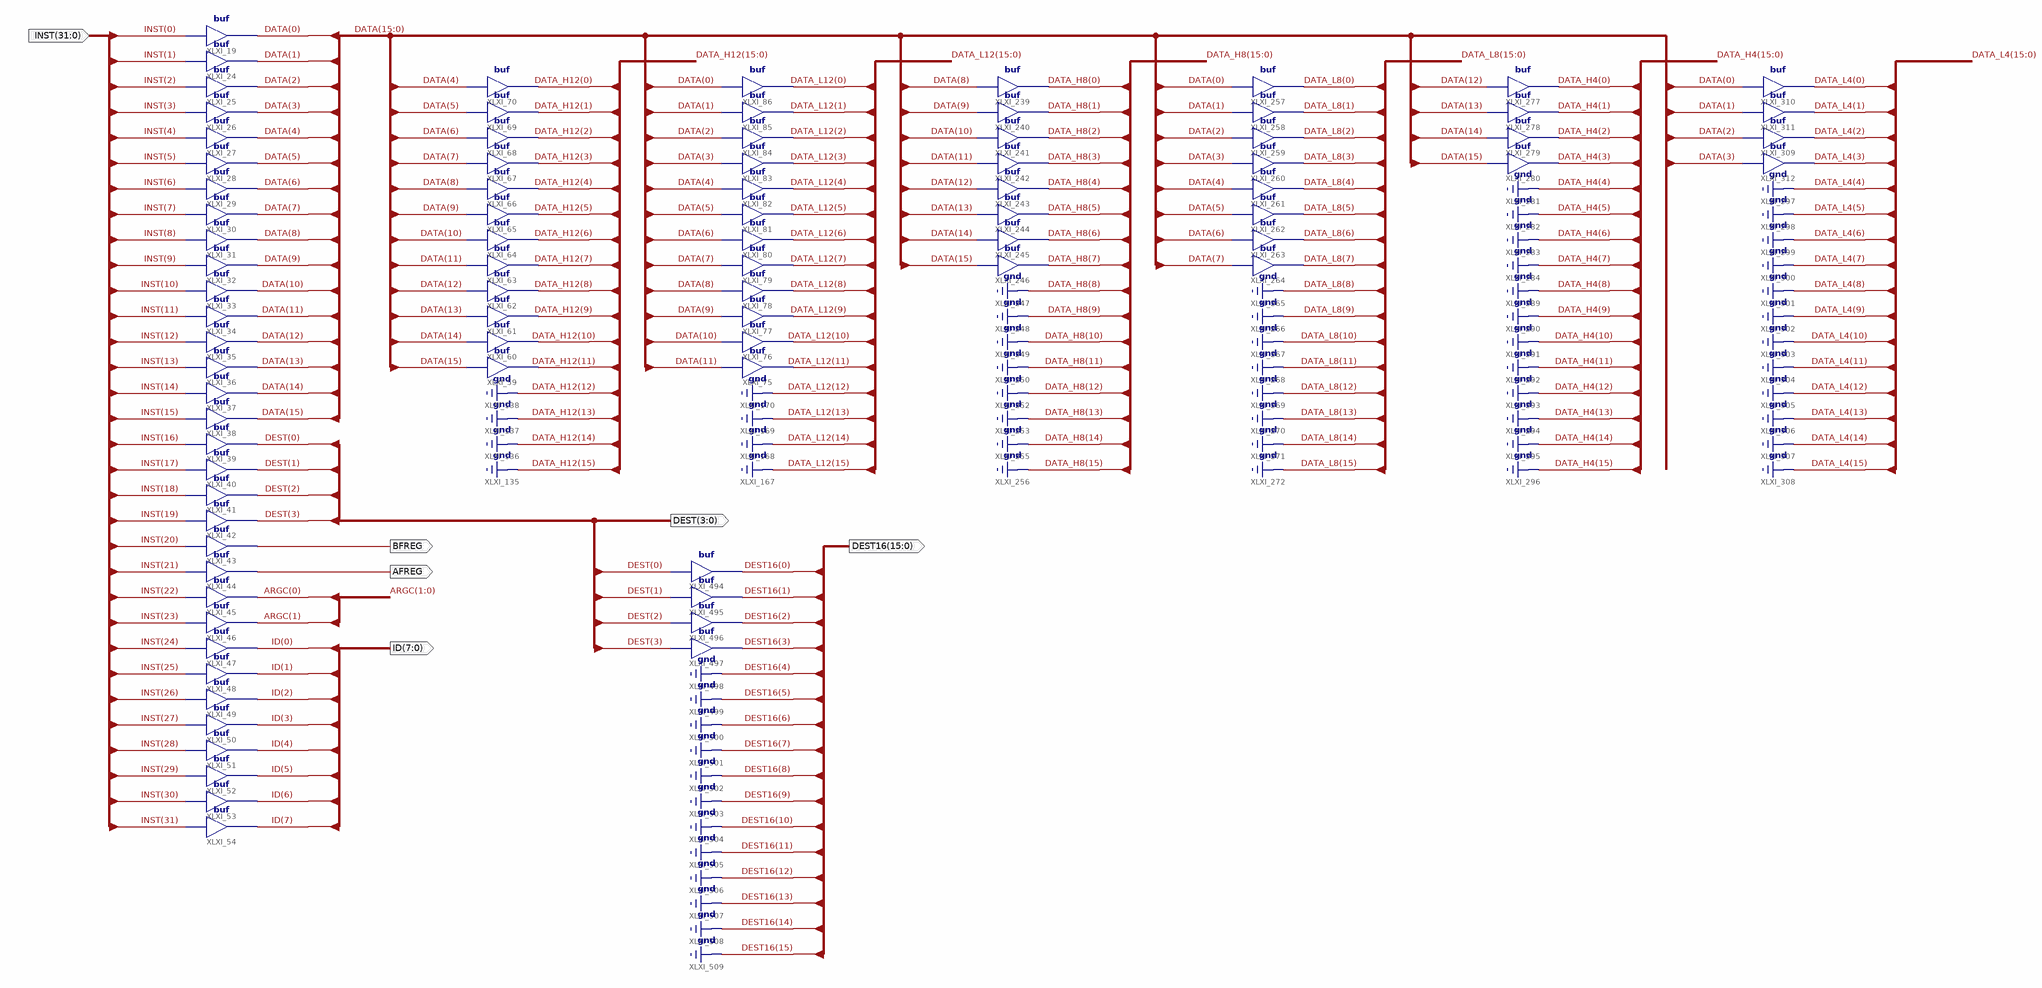
[diagram p0: schematic sheet 1]
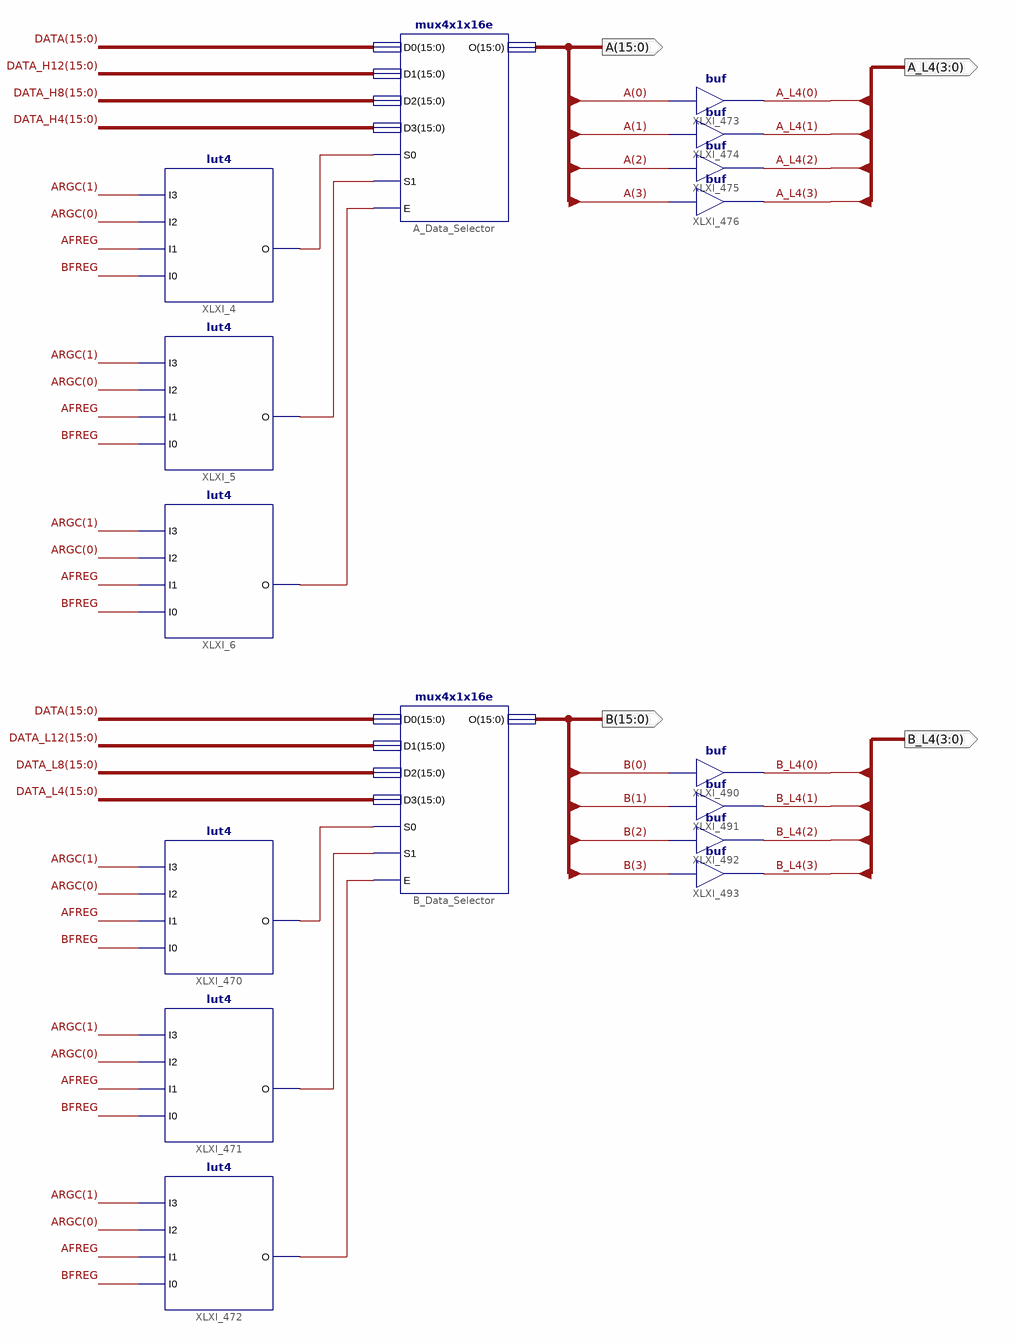
[diagram p1: schematic sheet 2]
// Xilinx ISE schematic idu.sch (spartan6) as structural Verilog: 100 symbols, 10 ports
module idu (
  input  [31:0] INST,
  output [15:0] A,
  output [7:0] ID,
  output [3:0] DEST,
  output BFREG,
  output AFREG,
  output [15:0] B,
  output [3:0] A_L4,
  output [3:0] B_L4,
  output [15:0] DEST16
);

  wire XLXN_3, XLXN_5, XLXN_6, XLXN_833, XLXN_834, XLXN_835;
  wire [1:0] ARGC;
  wire [3:0] DATA_H4, DATA_L4;
  wire [7:0] DATA_H8, DATA_L8;
  wire [11:0] DATA_H12, DATA_L12;
  wire [15:0] DATA;

  mux4x1x16e A_Data_Selector (
    .D0(DATA), .D1({4'b0000, DATA_H12}), .D2({{8{1'b0}}, DATA_H8}), .D3({{12{1'b0}}, DATA_H4}), .E(XLXN_6),
    .O(A), .S0(XLXN_3), .S1(XLXN_5));
  lut4 #(.INIT("0600")) XLXI_4 (.I0(BFREG), .I1(AFREG), .I2(ARGC[0]), .I3(ARGC[1]), .O(XLXN_3));
  lut4 #(.INIT("0D00")) XLXI_5 (.I0(BFREG), .I1(AFREG), .I2(ARGC[0]), .I3(ARGC[1]), .O(XLXN_5));
  lut4 #(.INIT("0FF0")) XLXI_6 (.I0(BFREG), .I1(AFREG), .I2(ARGC[0]), .I3(ARGC[1]), .O(XLXN_6));
  buf XLXI_19 (DATA[0], INST[0]);
  buf XLXI_24 (DATA[1], INST[1]);
  buf XLXI_25 (DATA[2], INST[2]);
  buf XLXI_26 (DATA[3], INST[3]);
  buf XLXI_27 (DATA[4], INST[4]);
  buf XLXI_28 (DATA[5], INST[5]);
  buf XLXI_29 (DATA[6], INST[6]);
  buf XLXI_30 (DATA[7], INST[7]);
  buf XLXI_31 (DATA[8], INST[8]);
  buf XLXI_32 (DATA[9], INST[9]);
  buf XLXI_33 (DATA[10], INST[10]);
  buf XLXI_34 (DATA[11], INST[11]);
  buf XLXI_35 (DATA[12], INST[12]);
  buf XLXI_36 (DATA[13], INST[13]);
  buf XLXI_37 (DATA[14], INST[14]);
  buf XLXI_38 (DATA[15], INST[15]);
  buf XLXI_39 (DEST[0], INST[16]);
  buf XLXI_40 (DEST[1], INST[17]);
  buf XLXI_41 (DEST[2], INST[18]);
  buf XLXI_42 (DEST[3], INST[19]);
  buf XLXI_43 (BFREG, INST[20]);
  buf XLXI_44 (AFREG, INST[21]);
  buf XLXI_45 (ARGC[0], INST[22]);
  buf XLXI_46 (ARGC[1], INST[23]);
  buf XLXI_47 (ID[0], INST[24]);
  buf XLXI_48 (ID[1], INST[25]);
  buf XLXI_49 (ID[2], INST[26]);
  buf XLXI_50 (ID[3], INST[27]);
  buf XLXI_51 (ID[4], INST[28]);
  buf XLXI_52 (ID[5], INST[29]);
  buf XLXI_53 (ID[6], INST[30]);
  buf XLXI_54 (ID[7], INST[31]);
  buf XLXI_60 (DATA_H12[10], DATA[14]);
  buf XLXI_61 (DATA_H12[9], DATA[13]);
  buf XLXI_62 (DATA_H12[8], DATA[12]);
  buf XLXI_63 (DATA_H12[7], DATA[11]);
  buf XLXI_64 (DATA_H12[6], DATA[10]);
  buf XLXI_65 (DATA_H12[5], DATA[9]);
  buf XLXI_66 (DATA_H12[4], DATA[8]);
  buf XLXI_67 (DATA_H12[3], DATA[7]);
  buf XLXI_68 (DATA_H12[2], DATA[6]);
  buf XLXI_69 (DATA_H12[1], DATA[5]);
  buf XLXI_70 (DATA_H12[0], DATA[4]);
  buf XLXI_75 (DATA_L12[11], DATA[11]);
  buf XLXI_76 (DATA_L12[10], DATA[10]);
  buf XLXI_77 (DATA_L12[9], DATA[9]);
  buf XLXI_78 (DATA_L12[8], DATA[8]);
  buf XLXI_79 (DATA_L12[7], DATA[7]);
  buf XLXI_80 (DATA_L12[6], DATA[6]);
  buf XLXI_81 (DATA_L12[5], DATA[5]);
  buf XLXI_82 (DATA_L12[4], DATA[4]);
  buf XLXI_83 (DATA_L12[3], DATA[3]);
  buf XLXI_84 (DATA_L12[2], DATA[2]);
  buf XLXI_85 (DATA_L12[1], DATA[1]);
  buf XLXI_86 (DATA_L12[0], DATA[0]);
  buf XLXI_239 (DATA_H8[0], DATA[8]);
  buf XLXI_240 (DATA_H8[1], DATA[9]);
  buf XLXI_241 (DATA_H8[2], DATA[10]);
  buf XLXI_242 (DATA_H8[3], DATA[11]);
  buf XLXI_243 (DATA_H8[4], DATA[12]);
  buf XLXI_244 (DATA_H8[5], DATA[13]);
  buf XLXI_245 (DATA_H8[6], DATA[14]);
  buf XLXI_246 (DATA_H8[7], DATA[15]);
  buf XLXI_257 (DATA_L8[0], DATA[0]);
  buf XLXI_258 (DATA_L8[1], DATA[1]);
  buf XLXI_259 (DATA_L8[2], DATA[2]);
  buf XLXI_260 (DATA_L8[3], DATA[3]);
  buf XLXI_261 (DATA_L8[4], DATA[4]);
  buf XLXI_262 (DATA_L8[5], DATA[5]);
  buf XLXI_263 (DATA_L8[6], DATA[6]);
  buf XLXI_264 (DATA_L8[7], DATA[7]);
  buf XLXI_59 (DATA_H12[11], DATA[15]);
  buf XLXI_277 (DATA_H4[0], DATA[12]);
  buf XLXI_278 (DATA_H4[1], DATA[13]);
  buf XLXI_279 (DATA_H4[2], DATA[14]);
  buf XLXI_280 (DATA_H4[3], DATA[15]);
  buf XLXI_309 (DATA_L4[2], DATA[2]);
  buf XLXI_310 (DATA_L4[0], DATA[0]);
  buf XLXI_311 (DATA_L4[1], DATA[1]);
  buf XLXI_312 (DATA_L4[3], DATA[3]);
  mux4x1x16e B_Data_Selector (
    .D0(DATA), .D1({4'b0000, DATA_L12}), .D2({{8{1'b0}}, DATA_L8}), .D3({{12{1'b0}}, DATA_L4}), .E(XLXN_835),
    .O(B), .S0(XLXN_833), .S1(XLXN_834));
  lut4 #(.INIT("0600")) XLXI_470 (.I0(BFREG), .I1(AFREG), .I2(ARGC[0]), .I3(ARGC[1]), .O(XLXN_833));
  lut4 #(.INIT("0B00")) XLXI_471 (.I0(BFREG), .I1(AFREG), .I2(ARGC[0]), .I3(ARGC[1]), .O(XLXN_834));
  lut4 #(.INIT("0F00")) XLXI_472 (.I0(BFREG), .I1(AFREG), .I2(ARGC[0]), .I3(ARGC[1]), .O(XLXN_835));
  buf XLXI_473 (A_L4[0], A[0]);
  buf XLXI_474 (A_L4[1], A[1]);
  buf XLXI_475 (A_L4[2], A[2]);
  buf XLXI_476 (A_L4[3], A[3]);
  buf XLXI_490 (B_L4[0], B[0]);
  buf XLXI_491 (B_L4[1], B[1]);
  buf XLXI_492 (B_L4[2], B[2]);
  buf XLXI_493 (B_L4[3], B[3]);
  buf XLXI_494 (DEST16[0], DEST[0]);
  buf XLXI_495 (DEST16[1], DEST[1]);
  buf XLXI_496 (DEST16[2], DEST[2]);
  buf XLXI_497 (DEST16[3], DEST[3]);

  assign DEST16[15:4] = {12{1'b0}};
endmodule
